# EAGLE design valve_driver (EAGLE 9.0.1)
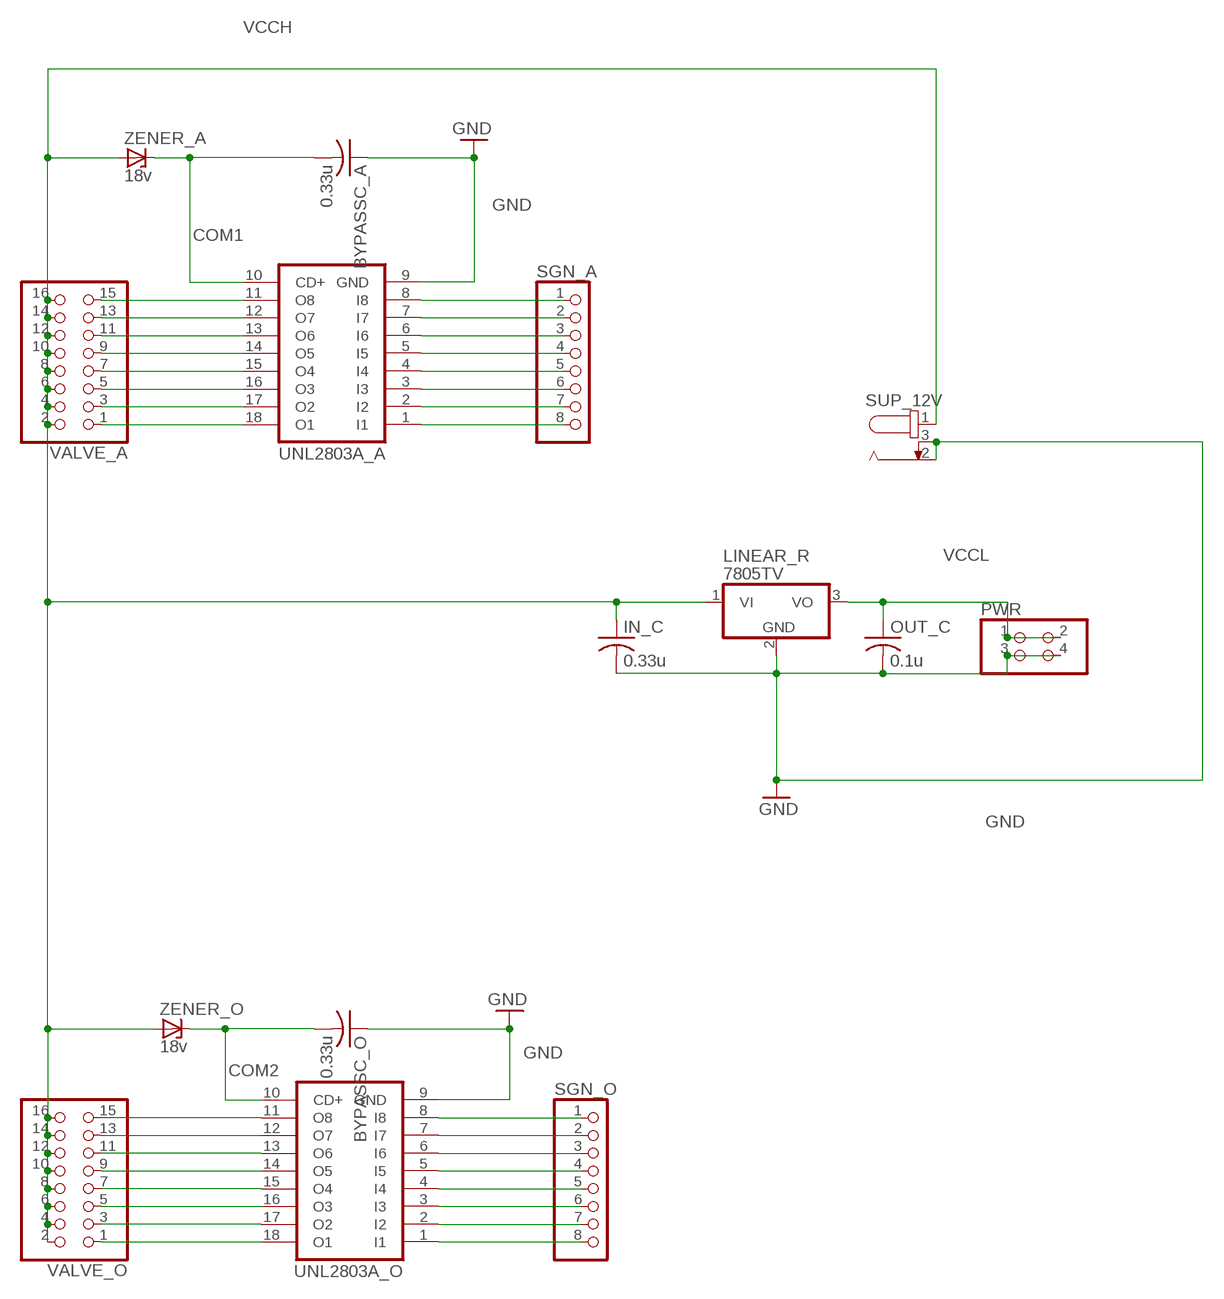
[diagram p0: schematic, sheet 1]

## Parts
BYPASSC_A  0.33u  C-US050-024X044  [C050-024X044]
BYPASSC_O  0.33u  C-US050-024X044  [C050-024X044]
IN_C  0.33u  C-US050-024X044  [C050-024X044]
LINEAR_R  7805TV  [TO220V]
OUT_C  0.1u  C-US050-024X044  [C050-024X044]
PWR  PINHD-2X2  [2X02]
SGN_A  PINHD-1X8  [1X08]
SGN_O  PINHD-1X8  [1X08]
SUP_12V  694108301002  [69410X301002]
UNL2803A_A  ULN2803A  [DIL18]
UNL2803A_O  ULN2803A  [DIL18]
VALVE_A  PINHD-2X8  [2X08]
VALVE_O  PINHD-2X8  [2X08]
ZENER_A  18v  1N821  [DO35Z10]
ZENER_O  18v  1N821  [DO35Z10]

## Nets
COM1: BYPASSC_A.2 UNL2803A_A.10(CD+) ZENER_A.C
COM2: BYPASSC_O.2 UNL2803A_O.10(CD+) ZENER_O.C
GND: BYPASSC_A.1 BYPASSC_O.1 IN_C.2 LINEAR_R.2(GND) OUT_C.2 PWR.3 PWR.4 SUP_12V.2 SUP_12V.3 UNL2803A_A.9(GND) UNL2803A_O.9(GND)
N$1: UNL2803A_O.11(O8) VALVE_O.15
N$2: UNL2803A_O.12(O7) VALVE_O.13
N$3: UNL2803A_O.13(O6) VALVE_O.11
N$7: UNL2803A_O.14(O5) VALVE_O.9
N$8: UNL2803A_O.15(O4) VALVE_O.7
N$9: UNL2803A_O.16(O3) VALVE_O.5
N$10: UNL2803A_O.17(O2) VALVE_O.3
N$11: UNL2803A_O.18(O1) VALVE_O.1
N$12: SGN_O.1 UNL2803A_O.8(I8)
N$13: SGN_O.2 UNL2803A_O.7(I7)
N$14: SGN_O.3 UNL2803A_O.6(I6)
N$15: SGN_O.4 UNL2803A_O.5(I5)
N$16: SGN_O.5 UNL2803A_O.4(I4)
N$17: SGN_O.6 UNL2803A_O.3(I3)
N$18: SGN_O.7 UNL2803A_O.2(I2)
N$19: SGN_O.8 UNL2803A_O.1(I1)
N$20: UNL2803A_A.11(O8) VALVE_A.15
N$21: UNL2803A_A.12(O7) VALVE_A.13
N$22: UNL2803A_A.13(O6) VALVE_A.11
N$23: UNL2803A_A.14(O5) VALVE_A.9
N$24: UNL2803A_A.15(O4) VALVE_A.7
N$25: UNL2803A_A.16(O3) VALVE_A.5
N$26: UNL2803A_A.17(O2) VALVE_A.3
N$27: UNL2803A_A.18(O1) VALVE_A.1
N$28: SGN_A.1 UNL2803A_A.8(I8)
N$29: SGN_A.2 UNL2803A_A.7(I7)
N$30: SGN_A.3 UNL2803A_A.6(I6)
N$31: SGN_A.4 UNL2803A_A.5(I5)
N$32: SGN_A.5 UNL2803A_A.4(I4)
N$33: SGN_A.6 UNL2803A_A.3(I3)
N$34: SGN_A.7 UNL2803A_A.2(I2)
N$35: SGN_A.8 UNL2803A_A.1(I1)
VCCH: IN_C.1 LINEAR_R.1(VI) SUP_12V.1 VALVE_A.2 VALVE_A.4 VALVE_A.6 VALVE_A.8 VALVE_A.10 VALVE_A.12 VALVE_A.14 VALVE_A.16 VALVE_O.2 VALVE_O.4 VALVE_O.6 VALVE_O.8 VALVE_O.10 VALVE_O.12 VALVE_O.14 VALVE_O.16 ZENER_A.A ZENER_O.A
VCCL: LINEAR_R.3(VO) OUT_C.1 PWR.1 PWR.2

## Library data of the parts
BYPASSC_A BYPASSC_O = resistor:C-US: CAPACITOR, American symbol; OC_NEWARK: unknown
IN_C OUT_C = adafruit:C-US: CAPACITOR, American symbol
LINEAR_R = linear:78*: Positive VOLTAGE REGULATOR Source: http://cache.national.com/ds/LM/LM78L05.pdf http://www.fairchildsemi.com/ds/LM/LM7805.pdf
PWR = pinhead:PINHD-2X2: PIN HEADER
SGN_A SGN_O = pinhead:PINHD-1X8: PIN HEADER
SUP_12V = mylib:694108301002: WR-DC_DC Power Jack_Right Angled_THT Center Pin Ø2.5_Plug ID Ø2.05_Plug OD Ø5.5 ;=>Code : Con_WR-DC_THT_694108301002_694108301002 <http://katalog.we-online.de/media/images/v2/Family_WR-DC_DC_Power_Jack_Right_Angled_THT_69410x301002.jpg> Details see: http://katalog.we-online.de/em/datasheet/6941xx301002.pdf Created 2014-10-08, Karrer Zheng 2014 (C) Wurth Elektronik
UNL2803A_A UNL2803A_O = uln-udn:ULN2803A: DRIVER ARRAY; OC_NEWARK: unknown
VALVE_A VALVE_O = pinhead:PINHD-2X8: PIN HEADER
ZENER_A ZENER_O = diode:1N821: Reference DIODE temperature compensated, 6,2 V; OC_NEWARK: unknown

## Net classes
0 default: width 0.305 mm, drill 0.508 mm, clearance 0.254 mm

## Board
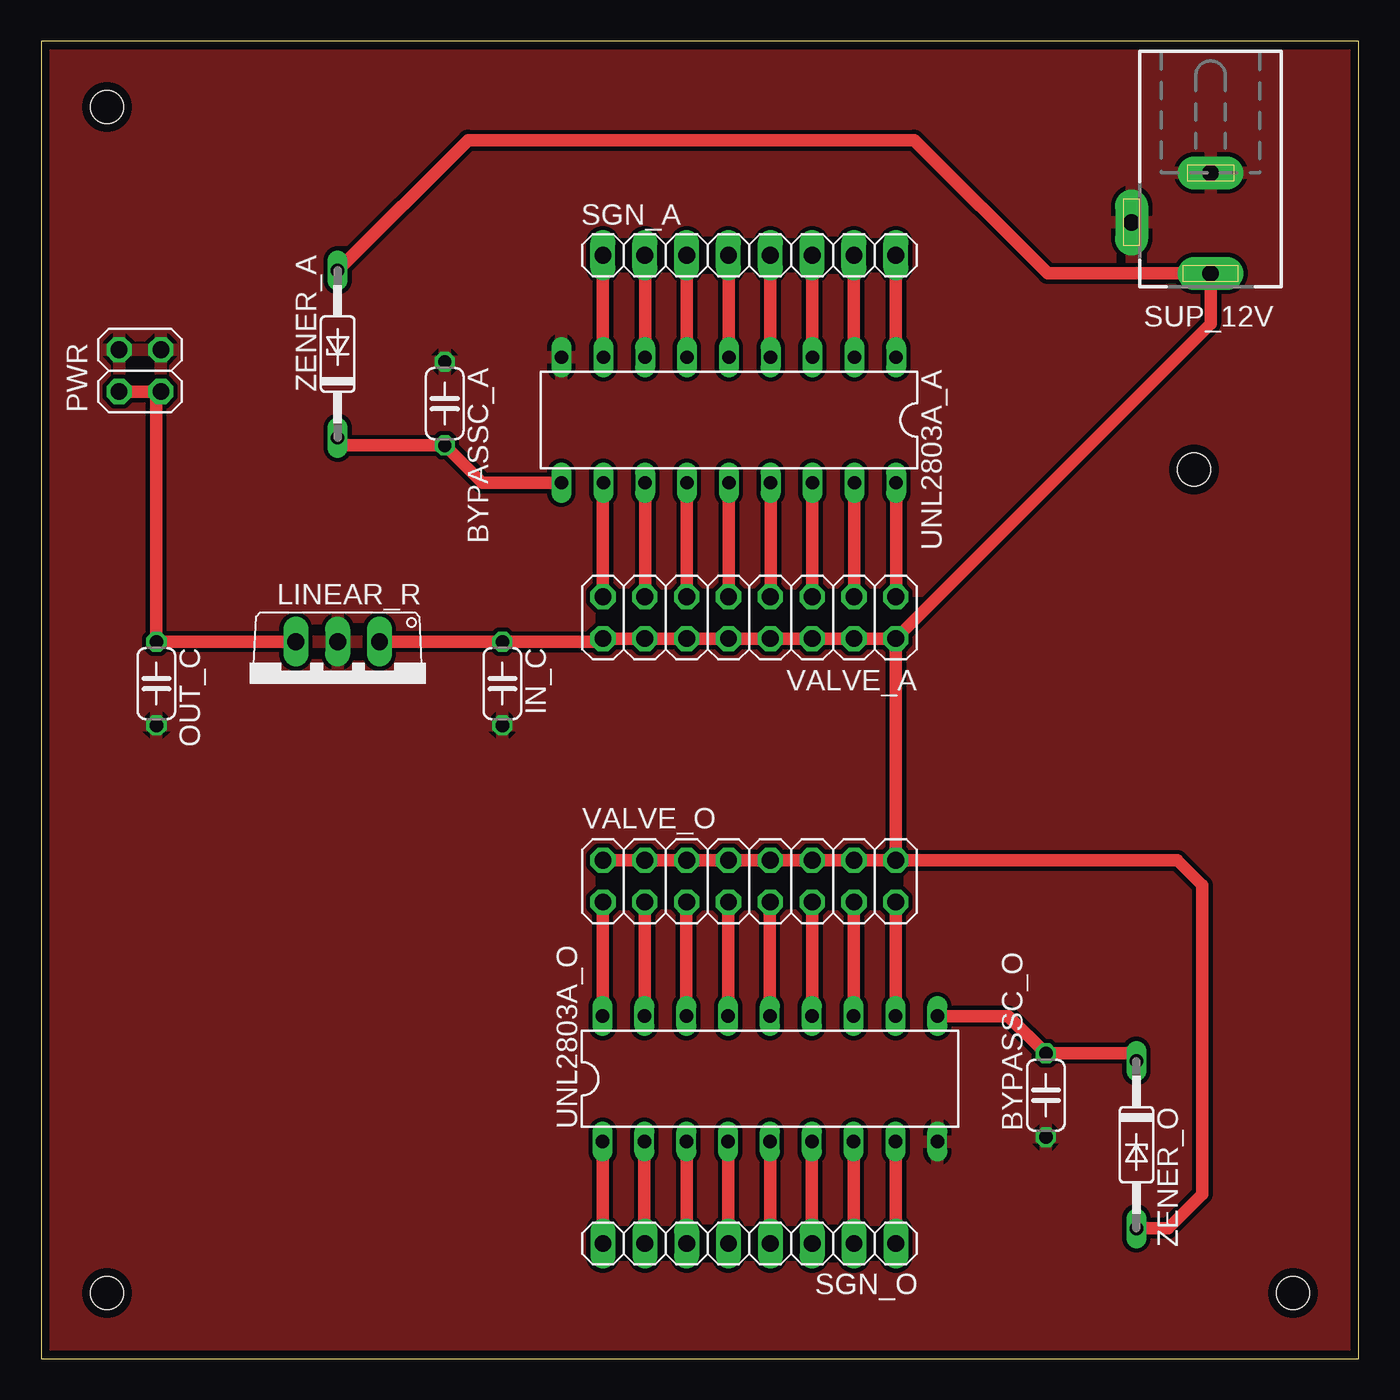
[diagram p1: board, top side]

Size 80 x 80 mm. Coordinates in mm from the lower left corner, seen from the top.
Outline: 0,0 80,0 80,80 0,80 0,0
Copper layers (1*16): Top 0.035mm / dielectric 1.53mm / Bottom 0.035mm
Design rules "pban_5mil-l2": minimum track width 5mil, minimum drill 0.3mm, track to track 5mil, track to pad 0.229mm, pad to pad 5mil, via to via 5mil, smd to smd 5mil, copper to edge 0.5mm, drill to drill 0.5mm, minimum pad ring 0.15mm, minimum via ring 0.15mm, stop-mask expansion 4mil, vias tented up to drill 0.35mm, thermal gap 10mil
Holes 2 mm at 4,4 76,4 70,54 4,76

### Footprints (pad centres in the part's own frame; a part is rotated, then mirrored left to right if it is on the bottom)
C050-024X044 = drill 0.813 octagon: 1 -2.54,0; 2 2.54,0
TO220V = drill 1.016 long: 1 -2.54,-2.54; 2 0,-2.54; 3 2.54,-2.54
2X02 = drill 1.016 octagon: 1 -1.27,-1.27; 2 -1.27,1.27; 3 1.27,-1.27; 4 1.27,1.27
1X08 = drill 1.016 long: 1 -8.89,0; 2 -6.35,0; 3 -3.81,0; 4 -1.27,0; 5 1.27,0; 6 3.81,0; 7 6.35,0; 8 8.89,0
DCJ0202 = drill 1 pad 2 long: 1 0,3.1; 2 4.8,0; 3 0,-3
DIL18 = drill 0.813 long: 1 -10.16,-3.81; 2 -7.62,-3.81; 3 -5.08,-3.81; 4 -2.54,-3.81; 5 0,-3.81; 6 2.54,-3.81; 7 5.08,-3.81; 8 7.62,-3.81; 9 10.16,-3.81; 10 10.16,3.81; 11 7.62,3.81; 12 5.08,3.81; 13 2.54,3.81; 14 0,3.81; 15 -2.54,3.81; 16 -5.08,3.81; 17 -7.62,3.81; 18 -10.16,3.81
2X08 = drill 1.016 octagon: 1 -8.89,-1.27; 2 -8.89,1.27; 3 -6.35,-1.27; 4 -6.35,1.27; 5 -3.81,-1.27; 6 -3.81,1.27; 7 -1.27,-1.27; 8 -1.27,1.27; 9 1.27,-1.27; 10 1.27,1.27; 11 3.81,-1.27; 12 3.81,1.27; 13 6.35,-1.27; 14 6.35,1.27; 15 8.89,-1.27; 16 8.89,1.27
DO35Z10 = drill 0.813 long: A 5.08,0; C -5.08,0

### Placement (x,y rotation side)
BYPASSC_A  24.5,58 270 top
BYPASSC_O  61,16 90 top
IN_C  28,41 270 top
LINEAR_R  18,41 180 top
OUT_C  7,41 270 top
PWR  6,60 90 top
SGN_A  43,67 0 top
SGN_O  43,7 180 top
SUP_12V  DCJ0202  [DCJ0202]  71,69 180 top
UNL2803A_A  41.75,57 180 top
UNL2803A_O  44.25,17 0 top
VALVE_A  43,45 180 top
VALVE_O  43,29 0 top
ZENER_A  18,61 90 top
ZENER_O  66.5,13 270 top

### Tracks (layer width: path | path; a pad name or v marks a point on that pad's centre or on a via)
COM1
  Top 0.762: ZENER_A.C 18.46,55.46 BYPASSC_A.2 26.77,53.19 UNL2803A_A.10
COM2
  Top 0.762: UNL2803A_O.10 58.73,20.81 BYPASSC_O.2 66.04,18.54 ZENER_O.C
GND
  pour Top: -1.75,81 -1.75,-3 82,-3 82,81
N$1
  Top 0.762: UNL2803A_O.11 51.87,27.71 VALVE_O.15
N$2
  Top 0.762: VALVE_O.13 49.35,20.83 UNL2803A_O.12
N$3
  Top 0.762: VALVE_O.11 46.81,20.83 UNL2803A_O.13
N$7
  Top 0.762: UNL2803A_O.14 44.25,27.71 VALVE_O.9
N$8
  Top 0.762: VALVE_O.7 41.73,20.83 UNL2803A_O.15
N$9
  Top 0.762: UNL2803A_O.16 39.17,27.71 VALVE_O.5
N$10
  Top 0.762: VALVE_O.3 36.65,20.83 UNL2803A_O.17
N$11
  Top 0.762: UNL2803A_O.18 34.09,27.71 VALVE_O.1
N$12
  Top 0.762: UNL2803A_O.8 51.87,7.02 SGN_O.1
N$13
  Top 0.762: SGN_O.2 49.35,13.17 UNL2803A_O.7
N$14
  Top 0.762: UNL2803A_O.6 46.79,7.02 SGN_O.3
N$15
  Top 0.762: SGN_O.4 44.27,13.17 UNL2803A_O.5
N$16
  Top 0.762: UNL2803A_O.4 41.71,7.02 SGN_O.5
N$17
  Top 0.762: SGN_O.6 39.19,13.17 UNL2803A_O.3
N$18
  Top 0.762: UNL2803A_O.2 36.63,7.02 SGN_O.7
N$19
  Top 0.762: SGN_O.8 34.11,13.17 UNL2803A_O.1
N$20
  Top 0.762: UNL2803A_A.11 34.11,53.17 VALVE_A.15
N$21
  Top 0.762: UNL2803A_A.12 36.67,46.29 VALVE_A.13
N$22
  Top 0.762: UNL2803A_A.13 39.21,46.29 VALVE_A.11
N$23
  Top 0.762: UNL2803A_A.14 41.75,46.29 VALVE_A.9
N$24
  Top 0.762: UNL2803A_A.15 44.29,46.29 VALVE_A.7
N$25
  Top 0.762: UNL2803A_A.16 46.83,46.29 VALVE_A.5
N$26
  Top 0.762: UNL2803A_A.17 49.37,46.29 VALVE_A.3
N$27
  Top 0.762: UNL2803A_A.18 51.91,46.29 VALVE_A.1
N$28
  Top 0.762: SGN_A.1 34.11,60.83 UNL2803A_A.8
N$29
  Top 0.762: UNL2803A_A.7 36.67,66.98 SGN_A.2
N$30
  Top 0.762: SGN_A.3 39.19,60.83 UNL2803A_A.6
N$31
  Top 0.762: UNL2803A_A.5 41.75,66.98 SGN_A.4
N$32
  Top 0.762: SGN_A.5 44.27,60.83 UNL2803A_A.4
N$33
  Top 0.762: UNL2803A_A.3 46.83,66.98 SGN_A.6
N$34
  Top 0.762: SGN_A.7 49.35,60.83 UNL2803A_A.2
N$35
  Top 0.762: SGN_A.8 51.89,60.83 UNL2803A_A.1
VCCH
  Top 0.762: VALVE_O.16 VALVE_O.14 VALVE_O.12 VALVE_O.10 VALVE_O.8 VALVE_O.6 VALVE_O.4 VALVE_O.2 | VALVE_A.2 VALVE_A.4 VALVE_A.6 VALVE_A.8 VALVE_A.10 VALVE_A.12 VALVE_A.14 VALVE_A.16 33.92,43.54 IN_C.1 LINEAR_R.1 | VALVE_A.2 VALVE_O.16 | VALVE_O.16 68.98,30.27 70.5,28.75 70.5,10 68.42,7.92 ZENER_O.A | ZENER_A.A 25.92,74 53,74 61.1,65.9 SUP_12V.1 71,62.84 VALVE_A.2
VCCL
  Top 0.762: LINEAR_R.3 OUT_C.1 7,58.46 PWR.1 PWR.2